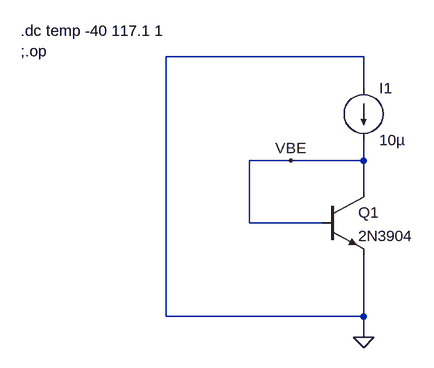
[diagram p0: schematic CTAT.asc]
CTAT.asc, the LTspice schematic file:
Version 4.1
SHEET 1 880 680
WIRE 256 -16 -48 -16
WIRE 256 32 256 -16
WIRE 144 144 80 144
WIRE 256 144 256 112
WIRE 256 144 144 144
WIRE 256 192 256 144
WIRE 80 240 80 144
WIRE 192 240 80 240
WIRE -48 384 -48 -16
WIRE 256 384 256 288
WIRE 256 384 -48 384
WIRE 256 416 256 384
FLAG 256 416 0
FLAG 144 144 VBE
SYMBOL npn 192 192 R0
SYMATTR InstName Q1
SYMATTR Value 2N3904
SYMBOL current 256 32 R0
SYMATTR InstName I1
SYMATTR Value 10µ
TEXT -272 -56 Left 2 !.dc temp -40 117.1 1\n;.op

The netlist it stands for:
* CTAT.asc
Q1 VBE VBE 0 0 2N3904
I1 0 VBE 10µ
.model NPN NPN
.model PNP PNP
.lib standard.bjt
.dc temp -40 117.1 1
;.op
.backanno
.end